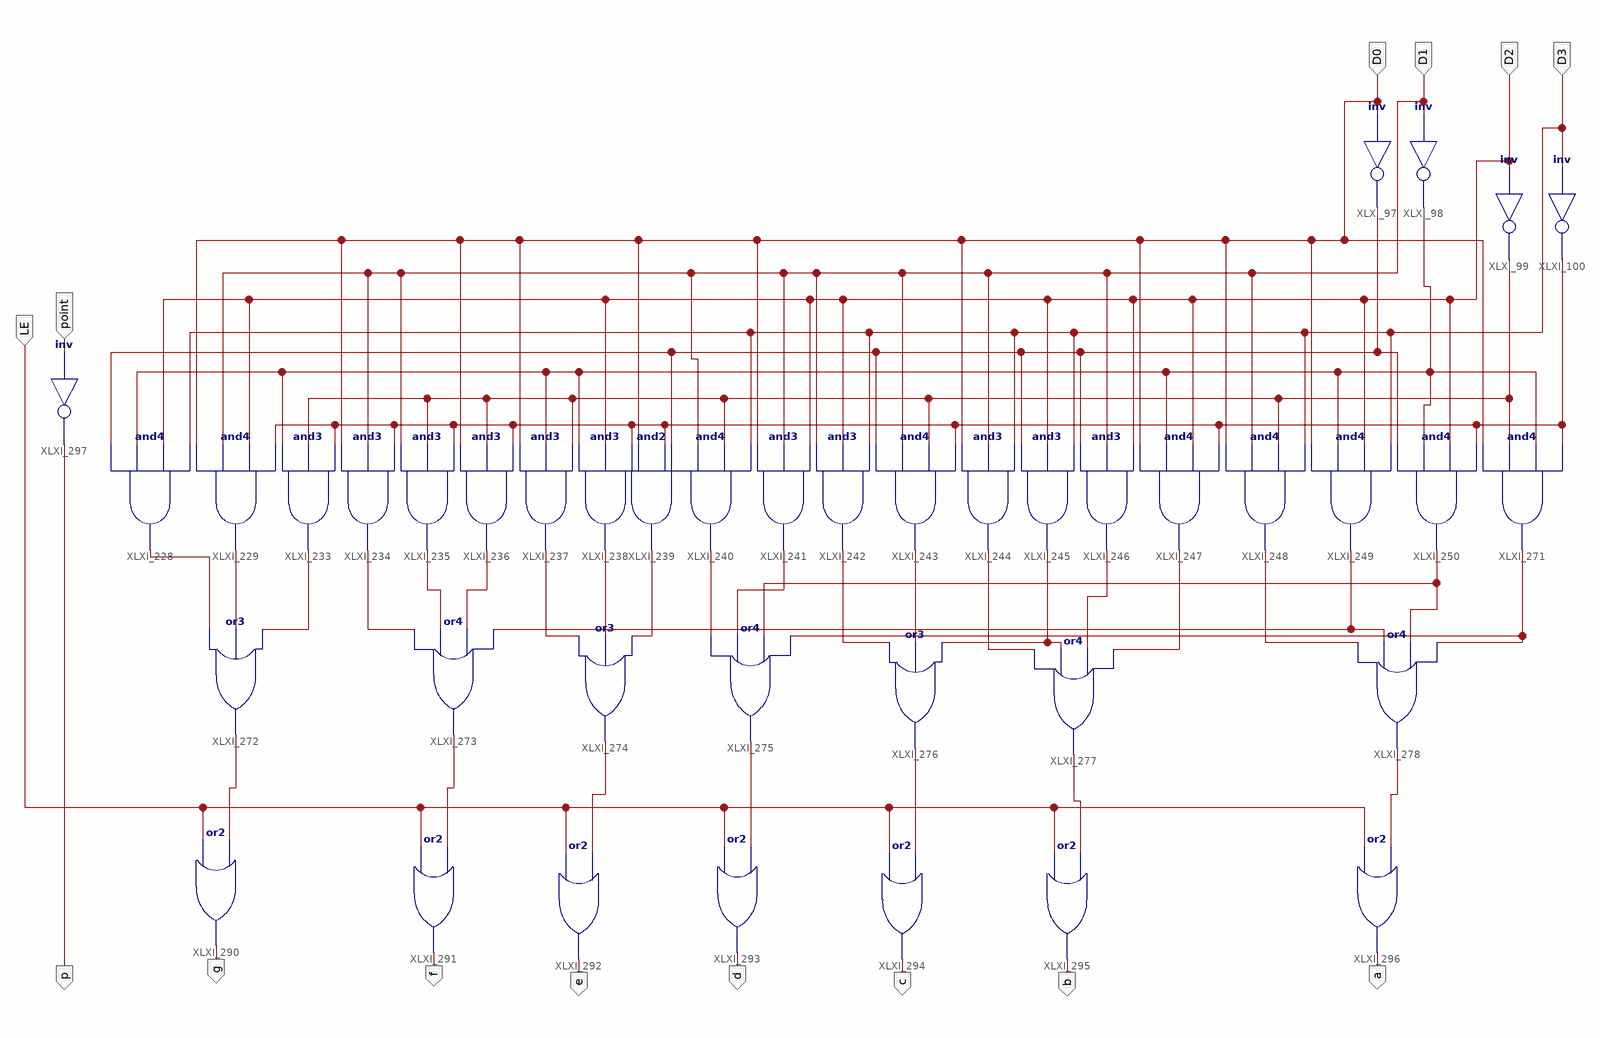
[diagram p0: schematic sheet 1]
// Xilinx ISE schematic MY_MC14495.sch (spartan3) as structural Verilog: 40 symbols, 14 ports
module MY_MC14495 (
  input  D3,
  input  D2,
  input  D1,
  input  D0,
  input  LE,
  input  point,
  output p,
  output g,
  output f,
  output e,
  output d,
  output c,
  output b,
  output a
);

  wire XLXN_129, XLXN_130, XLXN_131, XLXN_132, XLXN_133, XLXN_134, XLXN_135, XLXN_136, XLXN_137, XLXN_138,
       XLXN_139, XLXN_140, XLXN_141, XLXN_142, XLXN_143, XLXN_144, XLXN_145, XLXN_146, XLXN_148, XLXN_149,
       XLXN_152, XLXN_156, XLXN_158, XLXN_166, XLXN_171, XLXN_178, XLXN_179, XLXN_180, XLXN_184, XLXN_185,
       XLXN_186, XLXN_187;

  and XLXI_228 (XLXN_129, XLXN_171, XLXN_166, D2, D3);
  and XLXI_229 (XLXN_130, D0, D1, D2, XLXN_156);
  and XLXI_233 (XLXN_131, XLXN_166, XLXN_158, XLXN_156);
  and XLXI_234 (XLXN_132, D0, D1, XLXN_156);
  and XLXI_235 (XLXN_133, D1, XLXN_158, XLXN_156);
  and XLXI_236 (XLXN_134, D0, XLXN_158, XLXN_156);
  and XLXI_237 (XLXN_136, D0, XLXN_166, XLXN_158);
  and XLXI_238 (XLXN_137, XLXN_166, D2, XLXN_156);
  and XLXI_239 (XLXN_138, D0, XLXN_156);
  and XLXI_240 (XLXN_139, XLXN_171, D1, XLXN_158, D3);
  and XLXI_241 (XLXN_140, D0, D1, D2);
  and XLXI_242 (XLXN_143, D1, D2, D3);
  and XLXI_243 (XLXN_144, XLXN_171, D1, XLXN_158, XLXN_156);
  and XLXI_244 (XLXN_146, D0, D1, D3);
  and XLXI_245 (XLXN_145, XLXN_171, D2, D3);
  and XLXI_246 (XLXN_148, XLXN_171, D1, D2);
  and XLXI_247 (XLXN_149, D0, XLXN_166, D2, XLXN_156);
  and XLXI_248 (XLXN_152, D0, D1, XLXN_158, D3);
  and XLXI_249 (XLXN_135, D0, XLXN_166, D2, D3);
  and XLXI_250 (XLXN_141, XLXN_171, XLXN_166, D2, XLXN_156);
  and XLXI_271 (XLXN_142, D0, XLXN_158, XLXN_166, XLXN_156);
  or XLXI_272 (XLXN_187, XLXN_129, XLXN_130, XLXN_131);
  or XLXI_273 (XLXN_186, XLXN_132, XLXN_133, XLXN_134, XLXN_135);
  or XLXI_274 (XLXN_185, XLXN_136, XLXN_137, XLXN_138);
  or XLXI_275 (XLXN_184, XLXN_139, XLXN_140, XLXN_141, XLXN_142);
  or XLXI_276 (XLXN_180, XLXN_143, XLXN_144, XLXN_145);
  or XLXI_277 (XLXN_179, XLXN_146, XLXN_145, XLXN_148, XLXN_149);
  or XLXI_278 (XLXN_178, XLXN_152, XLXN_135, XLXN_141, XLXN_142);
  not XLXI_100 (XLXN_156, D3);
  not XLXI_99 (XLXN_158, D2);
  not XLXI_98 (XLXN_166, D1);
  not XLXI_97 (XLXN_171, D0);
  or XLXI_290 (g, LE, XLXN_187);
  or XLXI_291 (f, LE, XLXN_186);
  or XLXI_292 (e, LE, XLXN_185);
  or XLXI_293 (d, LE, XLXN_184);
  or XLXI_294 (c, LE, XLXN_180);
  or XLXI_295 (b, LE, XLXN_179);
  or XLXI_296 (a, LE, XLXN_178);
  not XLXI_297 (p, point);
endmodule
